# EAGLE design hepek-shield (EAGLE 7.2.0)
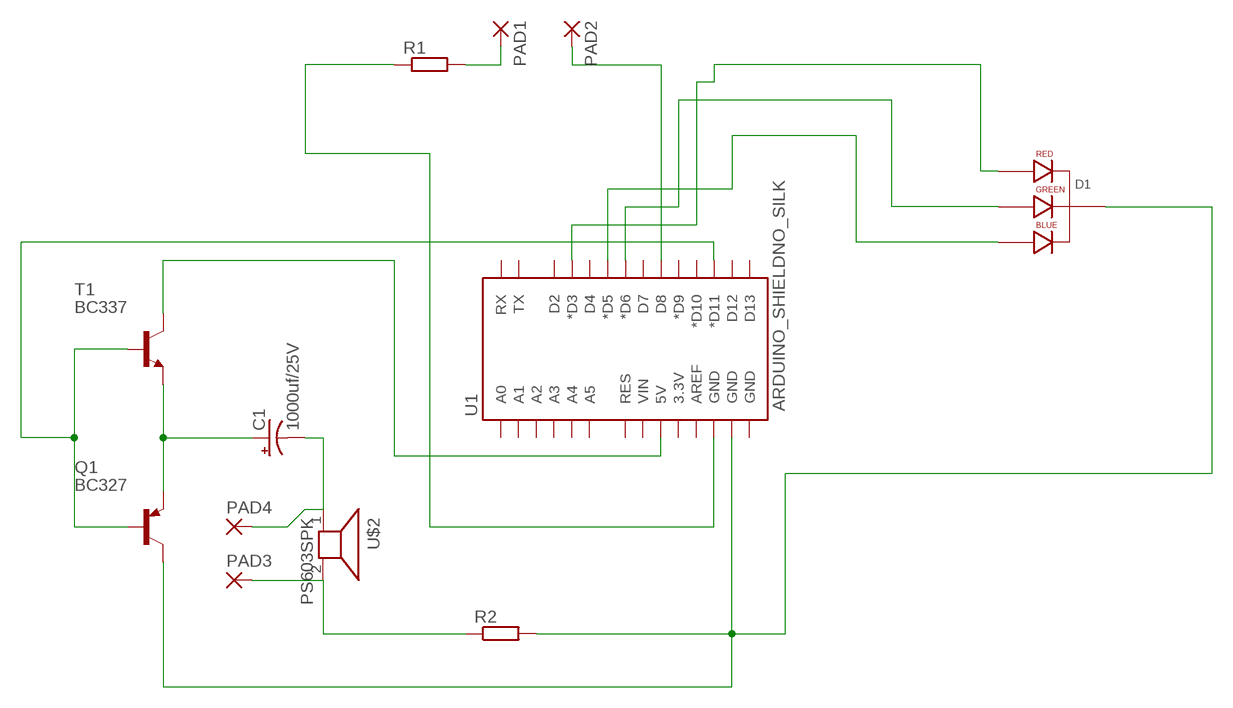
[diagram p0: schematic, sheet 1]

## Parts
C1  1000uf/25V  1000UF-25V(PTH)KIT  [CPOL-RADIAL-1000UF-25V-KIT]
D1  LED-RGB-CC-THRUCLEAR  [LED-RGB-THRU]
PAD1  2,15/1,0  [2,15/1,0]
PAD2  2,15/1,0  [2,15/1,0]
PAD3  2,15/1,0  [2,15/1,0]
PAD4  2,15/1,0  [2,15/1,0]
Q1  BC327  [TO92-EBC]
R1  R-EU_0204/7  [0204/7]
R2  R-EU_0204/7  [0204/7]
T1  BC337  [TO92]
U1  ARDUINO_SHIELDNO_SILK  [DUEMILANOVE_VIAS]
U$2  PS603SPK  [PS603]

## Nets
N$1: D1.1(RED_CATHODE) U1.D3(*D3)
N$2: D1.4(BLUE_CATHODE) U1.D5(*D5)
N$3: D1.3(GREEN_CATHODE) U1.D6(*D6)
N$4: PAD1.1(P) R1.2
N$5: PAD2.1(P) U1.D8
N$6: T1.3(C) U1.5V
N$7: PAD3.1(P) R2.1 U$2.2
N$8: C1.+ Q1.E T1.1(E)
N$9: C1.- PAD4.1(P) U$2.1
N$10: D1.2(CATHODE) Q1.C R2.2 U1.GND@1(GND)
N$12: Q1.B T1.2(B) U1.D11(*D11)
N$13: R1.1 U1.GND@2(GND)
Unconnected: U1.3.3V U1.A0 U1.A1 U1.A2 U1.A3 U1.A4 U1.A5 U1.AREF U1.D2 U1.D4 U1.D7 U1.D9(*D9) U1.D10(*D10) U1.D12 U1.D13 U1.GND@0(GND) U1.RES U1.RX U1.TX U1.VIN

## Library data of the parts
C1 = SparkFun-Capacitors:1000UF-25V(PTH): CAP-08070; PROD_ID: CAP-09538
D1 = SparkFun-LED:LED-RGB-CC-THRU: RGB Through-hole common cathode LED SparkFun Storefront: COM-00105 (Clear) COM-09264 (Diffuse); PROD_ID: DIO-08418
PAD1-PAD4 = wirepad:2,15/1,0: THROUGH-HOLE PAD
Q1 = transistor-pnp:BC327*: PNP Transistror
R1 R2 = rcl:R-EU_: RESISTOR, European symbol
T1 = transistor:BC337: NPN TRANSISTOR
U1 = SparkFun-Boards:ARDUINO_SHIELD: Arduino shield footprint
U$2 = adafruit:PS603: PS603 Small 8 ohm speaker, from Mouser. Can SMT solder to board http://www.ladyada.net/library/pcb/eaglelibrary.html

## Board
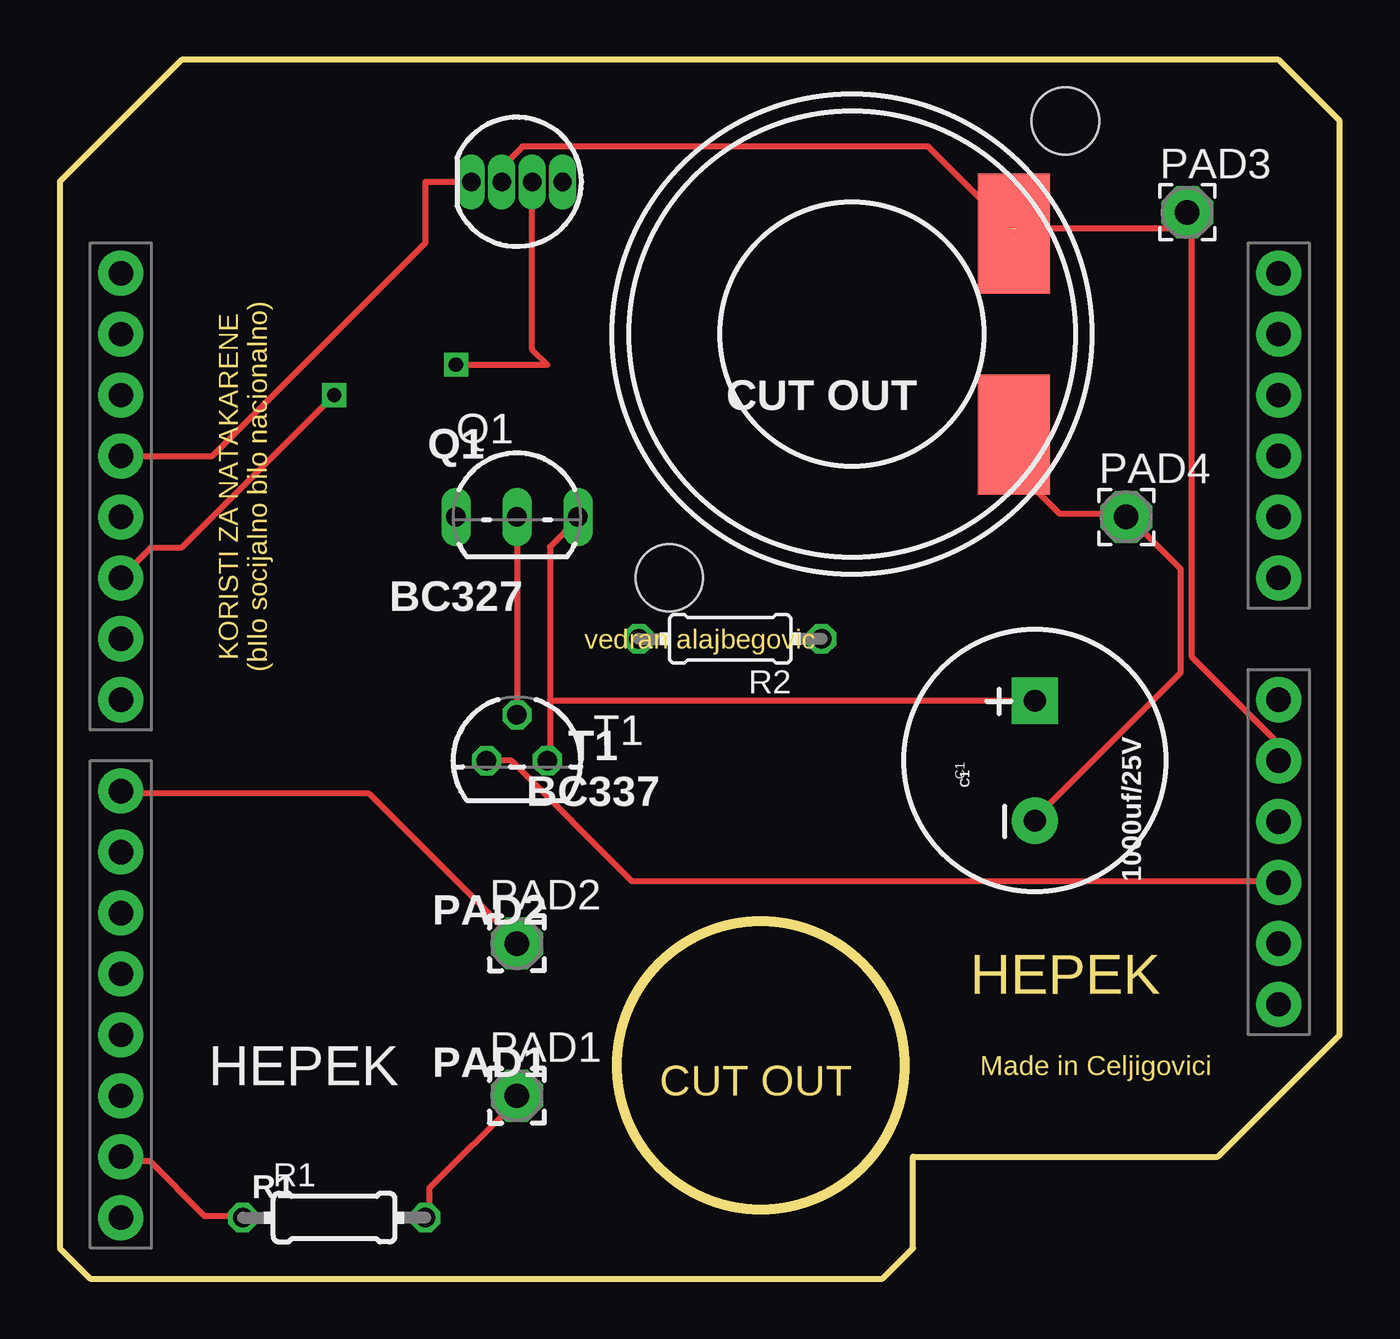
[diagram p1: board, top side]
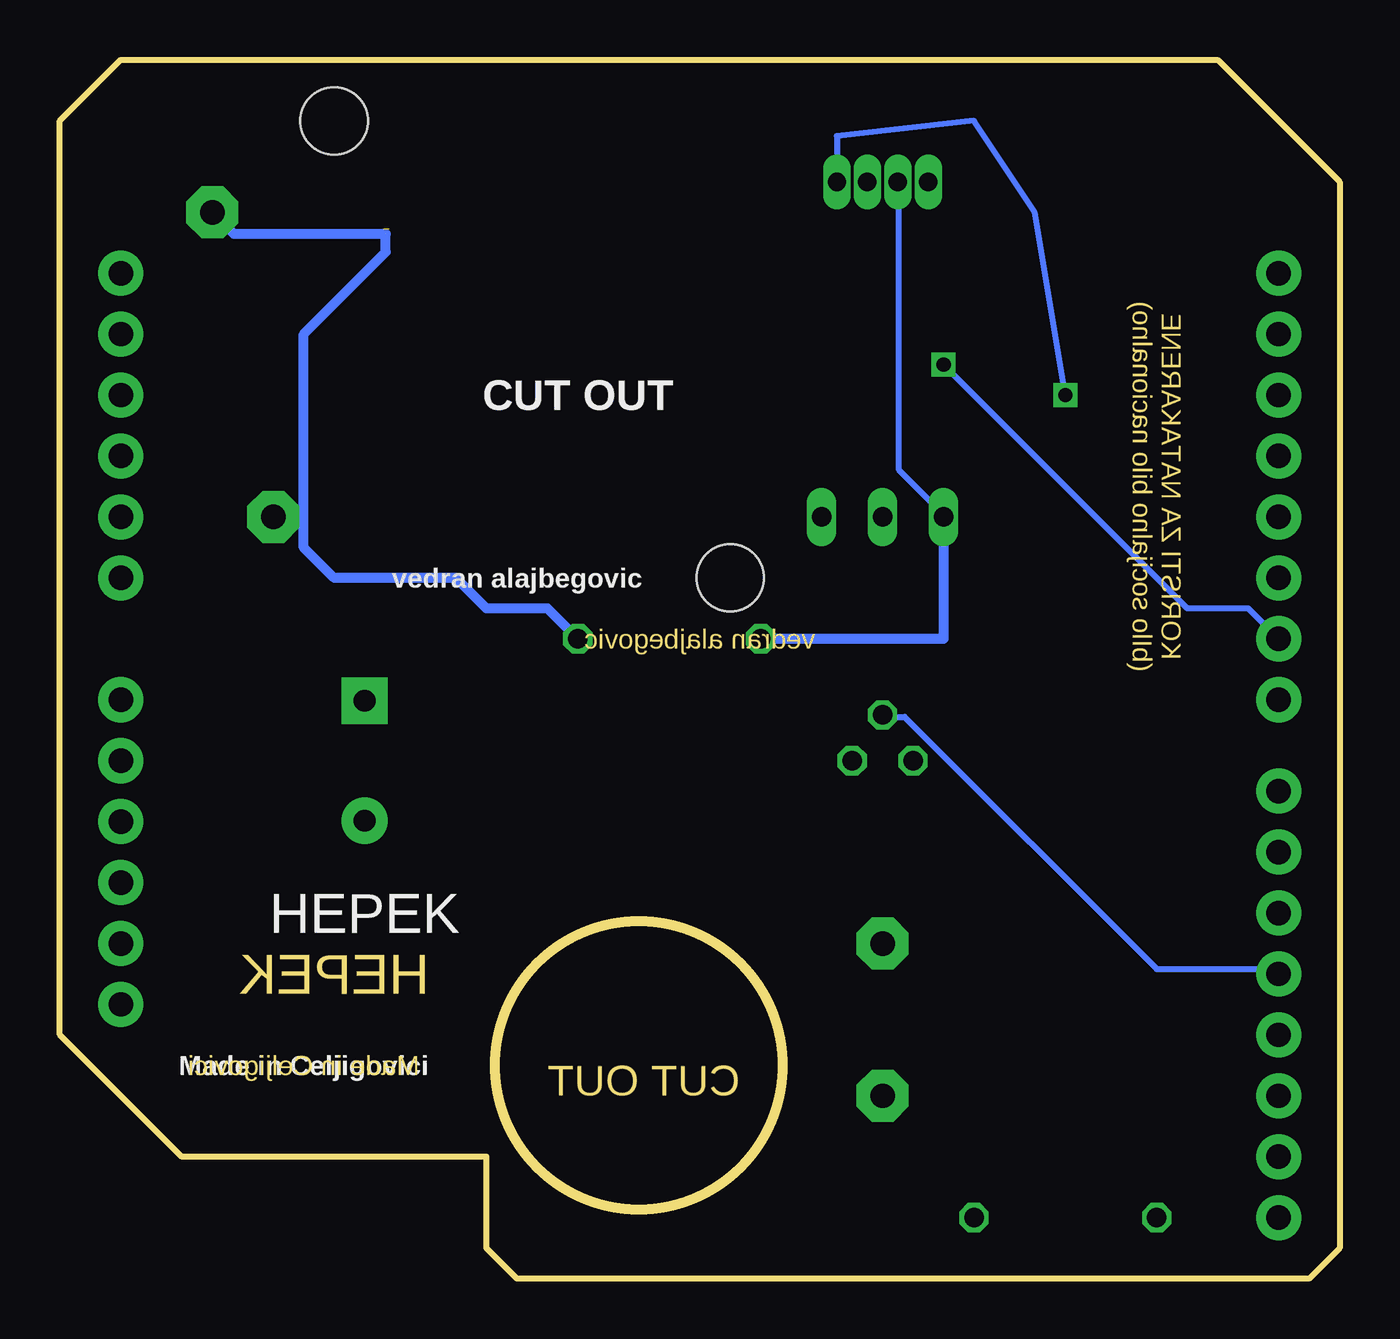
[diagram p2: board, bottom side, seen from below]

Size 53.34 x 50.8 mm. Coordinates in mm from the lower left corner, seen from the top.
Outline: 0,45.72 0,1.27 1.27,0 34.29,0 35.56,1.27 35.56,5.08 48.26,5.08 53.34,10.16 53.34,48.26 50.8,50.8 5.08,50.8 0,45.72
Outline: circle at 29.21,8.89 radius 6
Copper layers (1*16): Top 0.035mm / dielectric 1.5mm / Bottom 0.035mm
Design rules "default *": minimum track width 10mil, minimum drill 24mil, track to track 8mil, track to pad 8mil, pad to pad 8mil, via to via 8mil, smd to smd 8mil, copper to edge 40mil, drill to drill 8mil, minimum pad ring 5mil, minimum via ring 8mil, stop-mask expansion 4mil, vias tented up to drill 0mil, thermal gap 10mil
Holes 2.8 mm at 41.91,48.26 25.4,29.21

### Footprints (pad centres in the part's own frame; a part is rotated, then mirrored left to right if it is on the bottom)
CPOL-RADIAL-1000UF-25V-KIT = drill 0.9 pad 1.93 square: + 2.5,0 | drill 0.9 pad 1.93: - -2.5,0
LED-RGB-THRU = drill 0.762 pad 0.406 long: 1 1.905,0; 2 0.635,0; 3 -0.635,0; 4 -1.905,0
2,15/1,0 = drill 1.016 pad 2.159 octagon: 1 0,0
TO92-EBC = drill 0.813 long: B 0,-1.27; C -2.54,-1.27; E 2.54,-1.27
0204/7 = drill 0.813 octagon: 1 -3.81,0; 2 3.81,0
TO92 = drill 0.813 octagon: 1 1.27,0; 2 0,1.905; 3 -1.27,0
DUEMILANOVE_VIAS = drill 1.016 pad 1.88: 3.3V 50.8,13.97; 5V 50.8,16.51; A0 50.8,29.21; A1 50.8,31.75; A2 50.8,34.29; A3 50.8,36.83; A4 50.8,39.37; A5 50.8,41.91; AREF 2.54,2.54; D2 2.54,36.83; D3 2.54,34.29; D4 2.54,31.75; D5 2.54,29.21; D6 2.54,26.67; D7 2.54,24.13; D8 2.54,20.32; D9 2.54,17.78; D10 2.54,15.24; D11 2.54,12.7; D12 2.54,10.16; D13 2.54,7.62; GND@0 50.8,19.05; GND@1 50.8,21.59; GND@2 2.54,5.08; RES 50.8,11.43; RX 2.54,41.91; TX 2.54,39.37; VIN 50.8,24.13
PS603 = smd 5 x 3: 1 -4.184,-6.738; 2 4.184,-6.738

### Placement (x,y rotation side)
C1  40.64,21.59 90 top
D1  19.05,45.72 180 top
PAD1  19.05,7.62 0 top
PAD2  19.05,13.97 0 top
PAD3  46.99,44.45 0 top
PAD4  44.45,31.75 0 top
Q1  19.05,33.02 0 top
R1  11.43,2.54 0 top
R2  27.94,26.67 180 top
T1  19.05,21.59 0 top
U1  0,0 0 top
U$2  33.02,39.37 90 top

### Tracks (layer width: path | path; a pad name or v marks a point on that pad's centre or on a via)
N$1
  Top 0.254: U1.D3 6.35,34.29 15.24,43.18 15.24,45.72 D1.1
N$2  (via drill 0.6)
  Top 0.254: U1.D5 3.81,30.48 5.08,30.48 v11.43,36.83
  Bottom 0.254: v11.43,36.83 12.7,44.45 15.24,48.26 20.96,47.62 D1.4
N$3  (via drill 0.6)
  Top 0.254: v16.51,38.1 20.32,38.1 19.68,38.73 D1.3
  Bottom 0.254: U1.D6 3.81,27.94 6.35,27.94 v16.51,38.1
N$4
  Top 0.254: R1.2 15.39,2.62 15.39,3.76 19.05,7.42 PAD1.1
N$5
  Top 0.254: U1.D8 2.59,20.22 12.88,20.22 19.05,14.05 PAD2.1
N$6
  Top 0.254: T1.3 18.82,21.59 23.85,16.56 50.6,16.56 U1.5V
N$7  (1 unrouted)
  Bottom 0.406: R2.1 33.02,27.94 35.56,27.94 36.83,29.21 41.91,29.21 43.18,30.48 43.18,39.37 39.76,42.79 U$2.2 46.09,43.55 PAD3.1
N$8
  Top 0.254: 20.42,24.11 20.42,30.51 21.57,31.65 Q1.E | 20.42,24.11 20.42,21.59 T1.1 | 20.42,24.11 40.54,24.11 C1.+
N$9
  Top 0.254: C1.- 40.77,19.3 46.71,25.25 46.71,29.59 44.65,31.65 PAD4.1 44.42,31.88 41.68,31.88 39.85,33.71 39.85,35.08 U$2.1
  Top 0.406: 40.64,19.05 C1.-
N$10  (1 unrouted)
  Top 0.254: 47.17,44.45 47.17,43.76 | 47.17,43.76 47.17,25.93 50.6,22.5 50.6,21.59 U1.GND@1 | 47.17,43.76 39.85,43.76 | 39.62,43.76 36.2,47.19 19.28,47.19 18.59,46.51 18.59,45.82 D1.2
  Bottom 0.254: D1.2 18.36,45.59 18.36,33.71 16.54,31.88 Q1.C
  Bottom 0.406: Q1.C 16.51,26.67 R2.2
N$12
  Top 0.254: Q1.B T1.2
  Bottom 0.254: U1.D11 2.59,12.9 7.62,12.9 18.14,23.42 19.05,23.42 T1.2
N$13
  Top 0.254: R1.1 7.62,2.62 6.02,2.62 3.73,4.9 2.59,4.9 U1.GND@2

### Text on the board
Dimension: KORISTI ZA NATAKARENE / (bIlo socijalno bilo nacionalno) | vedran alajbegovic | HEPEK | CUT OUT | Made in Celjigovici
_tsilk: CUT OUT | Q1 | BC327 | T1 | BC337 | C1 | 1000uf/25V | PAD2 | PAD1 | HEPEK | R1
_bsilk: CUT OUT | vedran alajbegovic | HEPEK | Made in Celjigovici